# EAGLE schematic schematic (EAGLE 9.6.2)
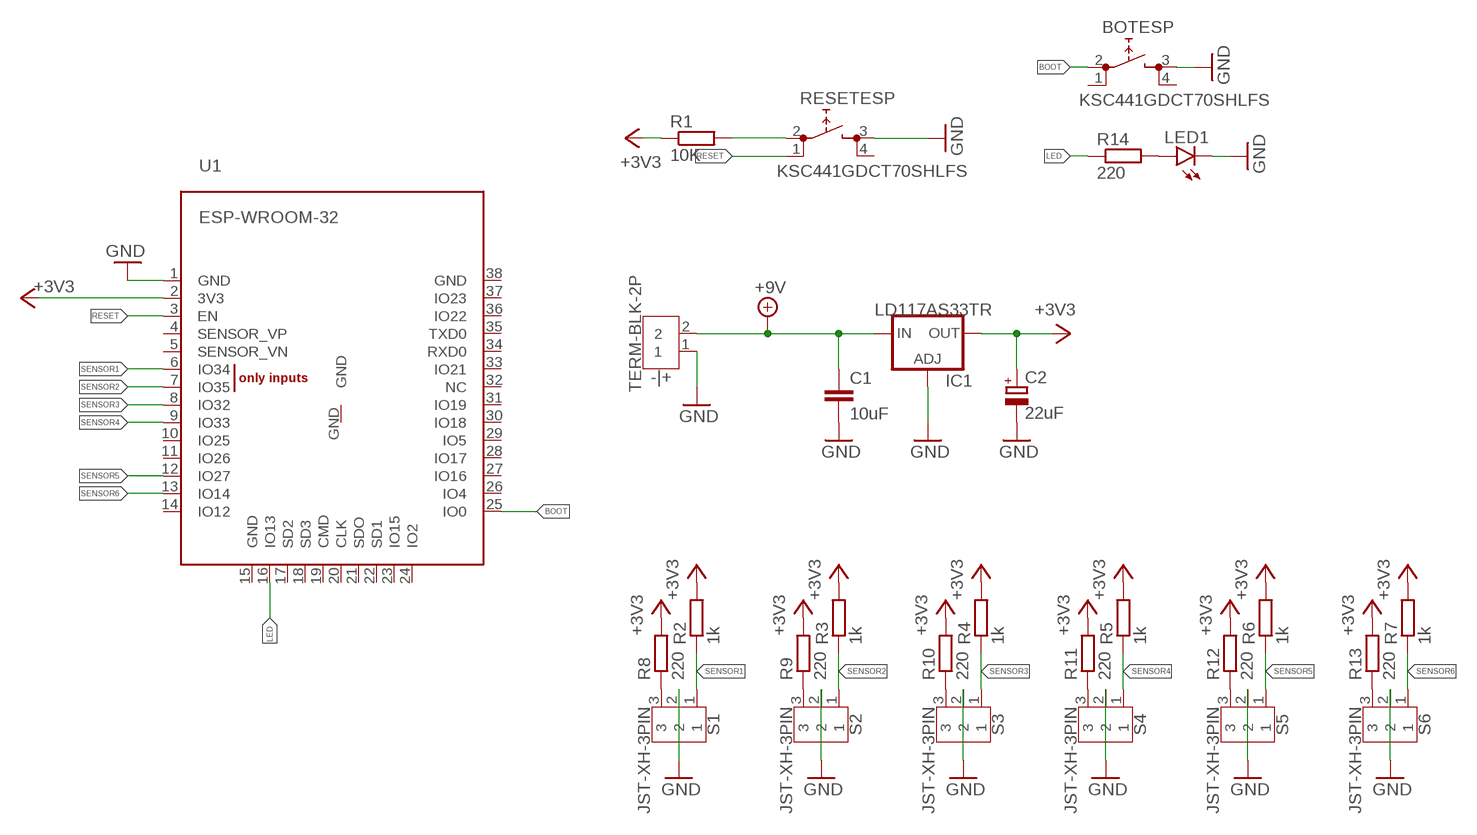
[diagram p0: schematic, sheet 1]

## Parts
-|+  TERM-BLK-2P  2828XX-2282834-2  [TERMBLK_254-2N]
BOTESP  KSC441GDCT70SHLFS  [KSC441GDCT70SHLFS]
C1  10uF  C-EUC0805  [C0805]
C2  22uF  CPOL-EUSMCB  [SMC_B]
IC1  LD117AS33TR  [SOT223]
LED1  LEDCHIP-LED0805  [CHIP-LED0805]
R1  10K  R-EU_R0805  [R0805]
R2  1k  R-EU_R0805  [R0805]
R3  1k  R-EU_R0805  [R0805]
R4  1k  R-EU_R0805  [R0805]
R5  1k  R-EU_R0805  [R0805]
R6  1k  R-EU_R0805  [R0805]
R7  1k  R-EU_R0805  [R0805]
R8  220  R-EU_R0805  [R0805]
R9  220  R-EU_R0805  [R0805]
R10  220  R-EU_R0805  [R0805]
R11  220  R-EU_R0805  [R0805]
R12  220  R-EU_R0805  [R0805]
R13  220  R-EU_R0805  [R0805]
R14  220  R-EU_R0805  [R0805]
RESETESP  KSC441GDCT70SHLFS  [KSC441GDCT70SHLFS]
S1  JST-XH-3PIN  B3B-XH-A  [B3B-XH-A]
S2  JST-XH-3PIN  B3B-XH-A  [B3B-XH-A]
S3  JST-XH-3PIN  B3B-XH-A  [B3B-XH-A]
S4  JST-XH-3PIN  B3B-XH-A  [B3B-XH-A]
S5  JST-XH-3PIN  B3B-XH-A  [B3B-XH-A]
S6  JST-XH-3PIN  B3B-XH-A  [B3B-XH-A]
U1  ESP-WROOM-32  [ESP-WROOM-32]

## Nets
+3V3: C2.+ IC1.4(OUT) R1.1 R2.2 R3.2 R4.2 R5.2 R6.2 R7.2 R8.2 R9.2 R10.2 R11.2 R12.2 R13.2 U1.2(3V3)
+9V: -|+.2 C1.1 IC1.3(IN)
BOOT: BOTESP.2 U1.25(IO0)
GND: -|+.1 BOTESP.3 C1.2 C2.- IC1.1(ADJ) LED1.C RESETESP.3 S1.2 S2.2 S3.2 S4.2 S5.2 S6.2 U1.1(GND)
LED: R14.1 U1.16(IO13)
N$1: R8.1 S1.3
N$2: R9.1 S2.3
N$3: R10.1 S3.3
N$4: R1.2 RESETESP.2
N$5: R11.1 S4.3
N$6: R12.1 S5.3
N$7: R13.1 S6.3
N$8: LED1.A R14.2
RESET: RESETESP.1 U1.3(EN)
SENSOR1: R2.1 S1.1 U1.6(IO34)
SENSOR2: R3.1 S2.1 U1.7(IO35)
SENSOR3: R4.1 S3.1 U1.8(IO32)
SENSOR4: R5.1 S4.1 U1.9(IO33)
SENSOR5: R6.1 S5.1 U1.12(IO27)
SENSOR6: R7.1 S6.1 U1.13(IO14)
Unconnected: BOTESP.1 BOTESP.4 RESETESP.4 U1.4(SENSOR_VP) U1.5(SENSOR_VN) U1.10(IO25) U1.11(IO26) U1.14(IO12) U1.15(GND) U1.17(SD2) U1.18(SD3) U1.19(CMD) U1.20(CLK) U1.21(SDO) U1.22(SD1) U1.23(IO15) U1.24(IO2) U1.26(IO4) U1.27(IO16) U1.28(IO17) U1.29(IO5) U1.30(IO18) U1.31(IO19) U1.32(NC) U1.33(IO21) U1.34(RXD0) U1.35(TXD0) U1.36(IO22) U1.37(IO23) U1.38(GND) U1.GND

## Library data of the parts
-|+ = Connector:2828XX-2: 2 Position Wire to Board Terminal Block Horizontal with Board Datasheet <https://www.te.com.cn/commerce/DocumentDelivery/DDEController?Action=showdoc&DocId=Catalog+Section%7F1308389_EUROSTYLE_TERMINAL_BLOCKS%7F0607%7Fpdf%7FEnglish%7FENG_CS_1308389_EUROSTYLE_TERMINAL_BLOCKS_0607.pdf%7F2-282837-5>; CATEGORY: Fixed Terminal Blocks; DESCRIPTION: Fixed Terminal Blocks 2P SIDE ENTRY 2.54mm; MANUFACTURER: TE Connectivity AMP Connectors; MPN: 282834-2; OPERATING_TEMPERATURE: -40°C ~ 105°C; PART_STATUS: Active; PITCH: 0.100" (2.54mm); ROHS_COMPLIANCE: RoHS Compliant; SERIES: Buchanan; SUBCATEGORY: Terminal Blocks; TYPE: Through Hole; Screw - Rising Cage Clamp; Side wire entry, Horizontal with Board
BOTESP RESETESP = Switch:KSC441GDCT70SHLFS: TACT 6.2 X 6.2, 5.2 MM H, 4.75N, Manufacturer's datasheet <https://www.ckswitches.com/media/2629/ksc-dct.pdf>; CREATED_BY: PCBLayout.com; DIGIKEY_PARTNO: CKN12187TR-ND; MANUFACTURER: C&K; MPN: KSC441G DCT 70SH LFS
C1 = rcl:C-EU: CAPACITOR, European symbol; SPICEPREFIX: C
C2 = rcl:CPOL-EU: POLARIZED CAPACITOR, European symbol; SPICEPREFIX: C
IC1 = v-reg:LD117A?*: Low drop fixed and adjustable positive voltage regulators 1 A Source: http://www.st.com/stonline/products/literature/ds/7194/ld1117axx.pdf
LED1 = led:LED: LED OSRAM: - CHIPLED LG R971, LG N971, LY N971, LG Q971, LY Q971, LO R971, LY R971 LH N974, LH R974 LS Q976, LO Q976, LY Q976 LO Q996 - Hyper CHIPLED LW Q18S LB Q993, LB Q99A, LB R99A - SideLED LS A670, LO A670, LY A670, LG A670, LP A670 LB A673, LV A673, LT A673, LW A673 LH A674 LY A675 LS A676, LA A676, LO A676, LY A676, LW A676 LS A679, LY A679, LG A679 - Hyper Micro SIDELED® LS Y876, LA Y876, LO Y876, LY Y876 LT Y87S - SmartLED LW L88C, LW L88S LB L89C, LB L89S, LG L890 LS L89K, LO L89K, LY L89K LS L896, LA L896, LO L896, LY L896 - TOPLED LS T670, LO T670, LY T670, LG T670, LP T670 LSG T670, LSP T670, LSY T670, LOP T670, LYG T670 LG T671, LOG T671, LSG T671 LB T673, LV T673, LT T673, LW T673 LH T674 LS T676, LA T676, LO T676, LY T676, LB T676, LH T676, LSB T676, LW T676 LB T67C, LV T67C, LT T67C, LS T67K, LO T67K, LY T67K, LW E67C LS E67B, LA E67B, LO E67B, LY E67B, LB E67C, LV E67C, LT E67C LW T67C LS T679, LY T679, LG T679 LS T770, LO T770, LY T770, LG T770, LP T770 LB T773, LV T773, LT T773, LW T773 LH T774 LS E675, LA E675, LY E675, LS T675 LS T776, LA T776, LO T776, LY T776, LB T776 LHGB T686 LT T68C, LB T68C - Hyper Mini TOPLED® LB M676 - Mini TOPLED Santana® LG M470 LS M47K, LO M47K, LY M47K Source: http://www.osram.convergy.de LUXEON: - LUMILED® LXK2-PW12-R00, LXK2-PW12-S00, LXK2-PW14-U00, LXK2-PW14-V00 LXK2-PM12-R00, LXK2-PM12-S00, LXK2-PM14-U00 LXK2-PE12-Q00, LXK2-PE12-R00, LXK2-PE12-S00, LXK2-PE14-T00, LXK2-PE14-U00 LXK2-PB12-K00, LXK2-PB12-L00, LXK2-PB12-M00, LXK2-PB14-N00, LXK2-PB14-P00, LXK2-PB14-Q00 LXK2-PR12-L00, LXK2-PR12-M00, LXK2-PR14-Q00, LXK2-PR14-R00 LXK2-PD12-Q00, LXK2-PD12-R00, LXK2-PD12-S00 LXK2-PH12-R00, LXK2-PH12-S00 LXK2-PL12-P00, LXK2-PL12-Q00, LXK2-PL12-R00 Source: www.luxeon.com KINGBRIGHT: KA-3528ASYC Source: www.kingbright.com
R1-R14 = rcl:R-EU_: RESISTOR, European symbol; SPICEPREFIX: R
S1-S6 = Connector:B3B-XH-A: XH Connector Top Entry - 3POS Details see: Datasheet <http://www.jst-mfg.com/product/pdf/eng/eXH.pdf>; CATEGORY: Header; DESCRIPTION: Connector Header Through Hole 3 position 0.098" (2.50mm); MANUFACTURER: JST Sales America Inc.; MPN: B3B-XH-A(LF)(SN); PART_STATUS: ACTIVE; PITCH: 0.098" (2.50mm); ROHS_COMPLIANCE: ROHS3 Compliant; SERIES: XH; SUB_CATEGORY: Rectangular Connectors; TYPE: Header, Male Pin, Board to Cable/Wire, Through Hole
U1 = esp32:ESP-WROOM-32